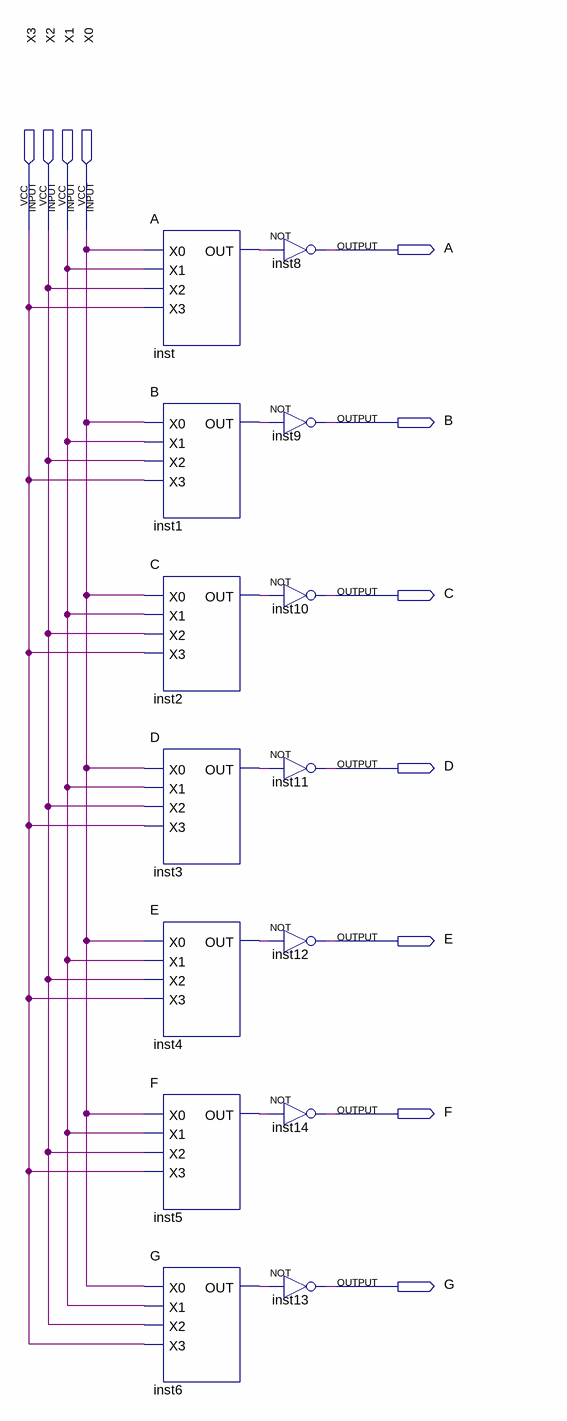
[diagram p0: schematic sheet]
// Quartus schematic BCD.bdf as structural Verilog: 14 symbols, 11 pins
module BCD (
  input  X3,
  input  X2,
  input  X1,
  input  X0,
  output A,
  output B,
  output C,
  output D,
  output E,
  output F,
  output G
);

  wire inst1_out, inst2_out, inst3_out, inst4_out, inst5_out, inst6_out, inst_out;

  A inst (.X0(X0), .X1(X1), .X2(X2), .X3(X3), .OUT(inst_out));
  B inst1 (.X0(X0), .X1(X1), .X2(X2), .X3(X3), .OUT(inst1_out));
  C inst2 (.X0(X0), .X1(X1), .X2(X2), .X3(X3), .OUT(inst2_out));
  D inst3 (.X0(X0), .X1(X1), .X2(X2), .X3(X3), .OUT(inst3_out));
  E inst4 (.X0(X0), .X1(X1), .X2(X2), .X3(X3), .OUT(inst4_out));
  F inst5 (.X0(X0), .X1(X1), .X2(X2), .X3(X3), .OUT(inst5_out));
  G inst6 (.X0(X0), .X1(X1), .X2(X2), .X3(X3), .OUT(inst6_out));
  not inst8 (A, inst_out);
  not inst9 (B, inst1_out);
  not inst10 (C, inst2_out);
  not inst11 (D, inst3_out);
  not inst12 (E, inst4_out);
  not inst14 (F, inst5_out);
  not inst13 (G, inst6_out);
endmodule
